# EAGLE design rf_ia (EAGLE 5.11)
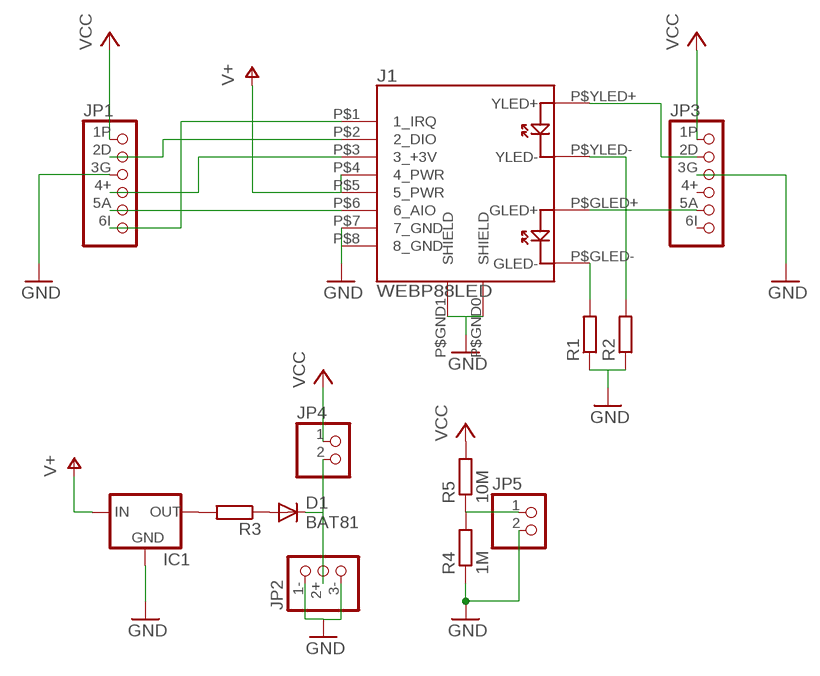
[diagram p0: schematic, sheet 1]

## Parts
D1  BAT81  [DO34-7]
IC1  78LXX  [78LXX]
J1  WEBP88LED  [WEBP88LED]
JP1  JEENODEPORT  [JEENODEPORT]
JP2  PWR3PIN  [PWR3PIN]
JP3  JEENODEPORT  [JEENODEPORT]
JP4  PINHD-1X2  [1X02]
JP5  PINHD-1X2  [1X02]
R1  R-EU_0207/7  [0207/7]
R2  R-EU_0207/7  [0207/7]
R3  R-EU_0204/7  [0204/7]
R4  1M  R-EU_0207/7  [0207/7]
R5  10M  R-EU_0207/7  [0207/7]

## Nets
GND: IC1.GND J1.P$7(7_GND) J1.P$8(8_GND) J1.P$GND0(SHIELD) J1.P$GND1(SHIELD) JP1.3G JP2.1- JP2.3- JP3.3G JP5.2 R1.1 R2.1 R4.1
N$1: J1.P$GLED-(GLED-) R1.2
N$2: J1.P$YLED-(YLED-) R2.2
N$3: D1.A R3.1
N$4: D1.C JP2.2+ JP4.2
N$6: J1.P$1(1_IRQ) JP1.6I
N$7: J1.P$2(2_DIO) JP1.2D
N$8: J1.P$3(3_+3V) JP1.4+
N$9: J1.P$6(6_AIO) JP1.5A
N$10: J1.P$YLED+(YLED+) JP3.2D
N$11: J1.P$GLED+(GLED+) JP3.5A
N$12: IC1.OUT R3.2
N$18: JP5.1 R4.2 R5.1
V_BATT: IC1.IN J1.P$4(4_PWR) J1.P$5(5_PWR) ; supply symbol labelled V+
VCC: JP1.1P JP3.1P JP4.1 R5.2
Unconnected: JP3.4+ JP3.6I

## Library data of the parts
D1 = diode:BAT81: DIODE barrier diode
IC1 = v-reg:78LXX: VOLTAGE REGULATOR
J1 = Prcek:WEBP88LED
JP1 JP3 = Prcek:JEENODEPORT: JeeNode Port
JP2 = Prcek:PWR3PIN: Power 3 PIN
JP4 JP5 = pinhead:PINHD-1X2: PIN HEADER
R1-R5 = resistor:R-EU_: RESISTOR, European symbol

## Board
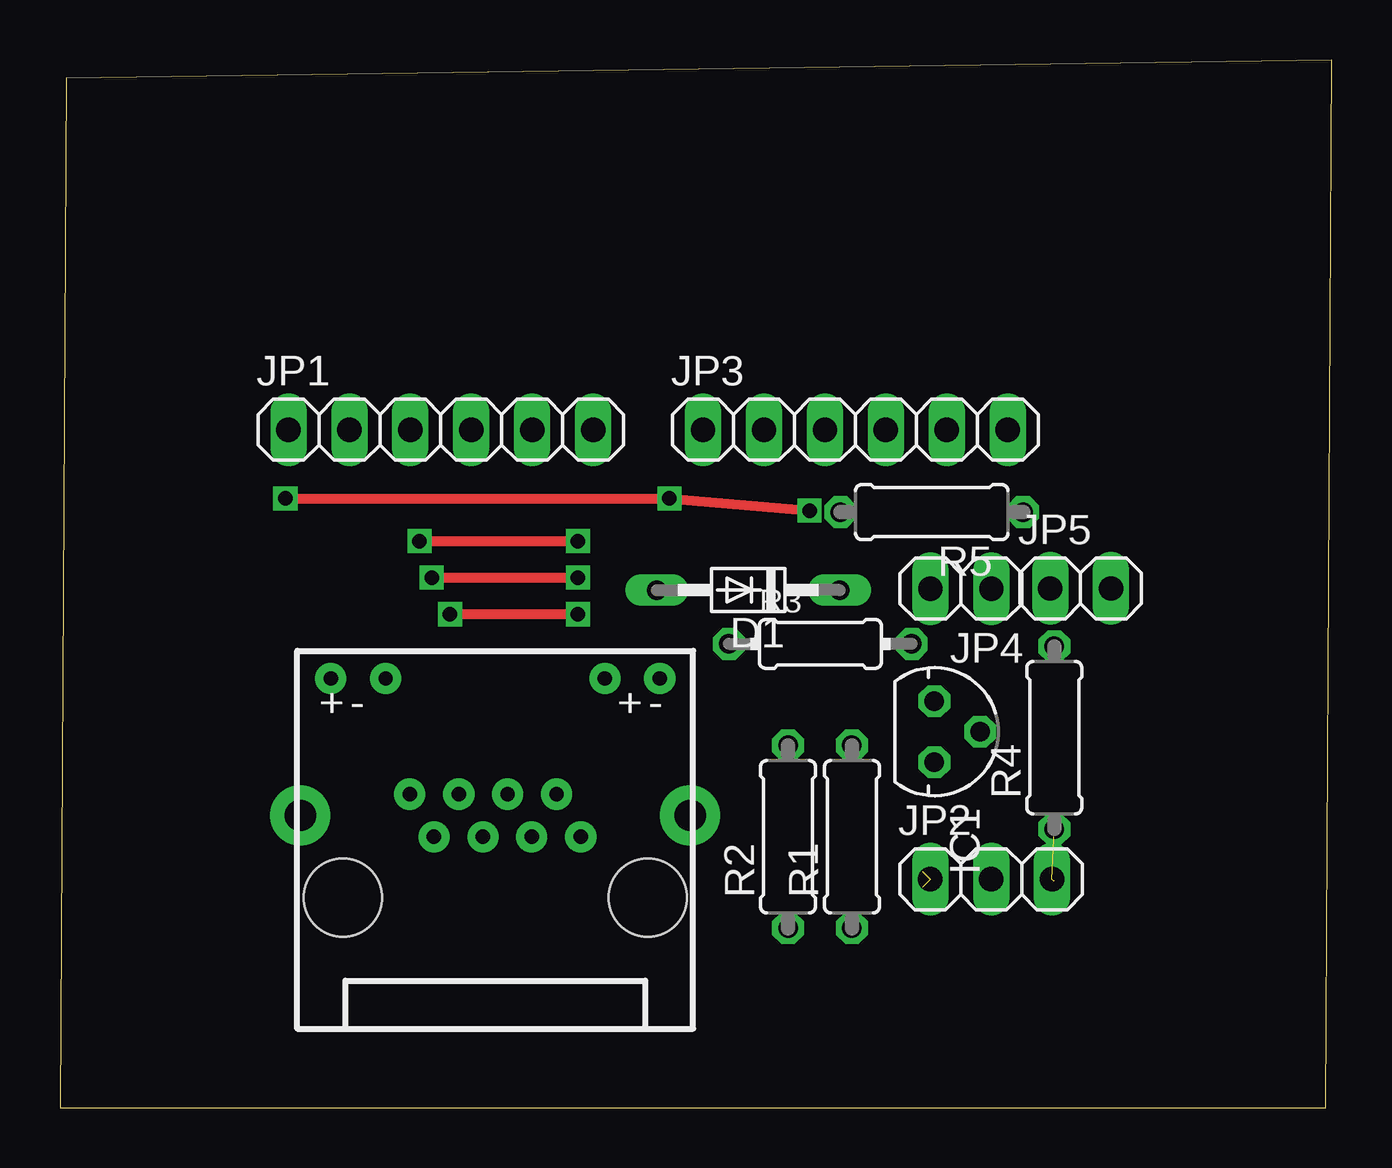
[diagram p1: board, top side]
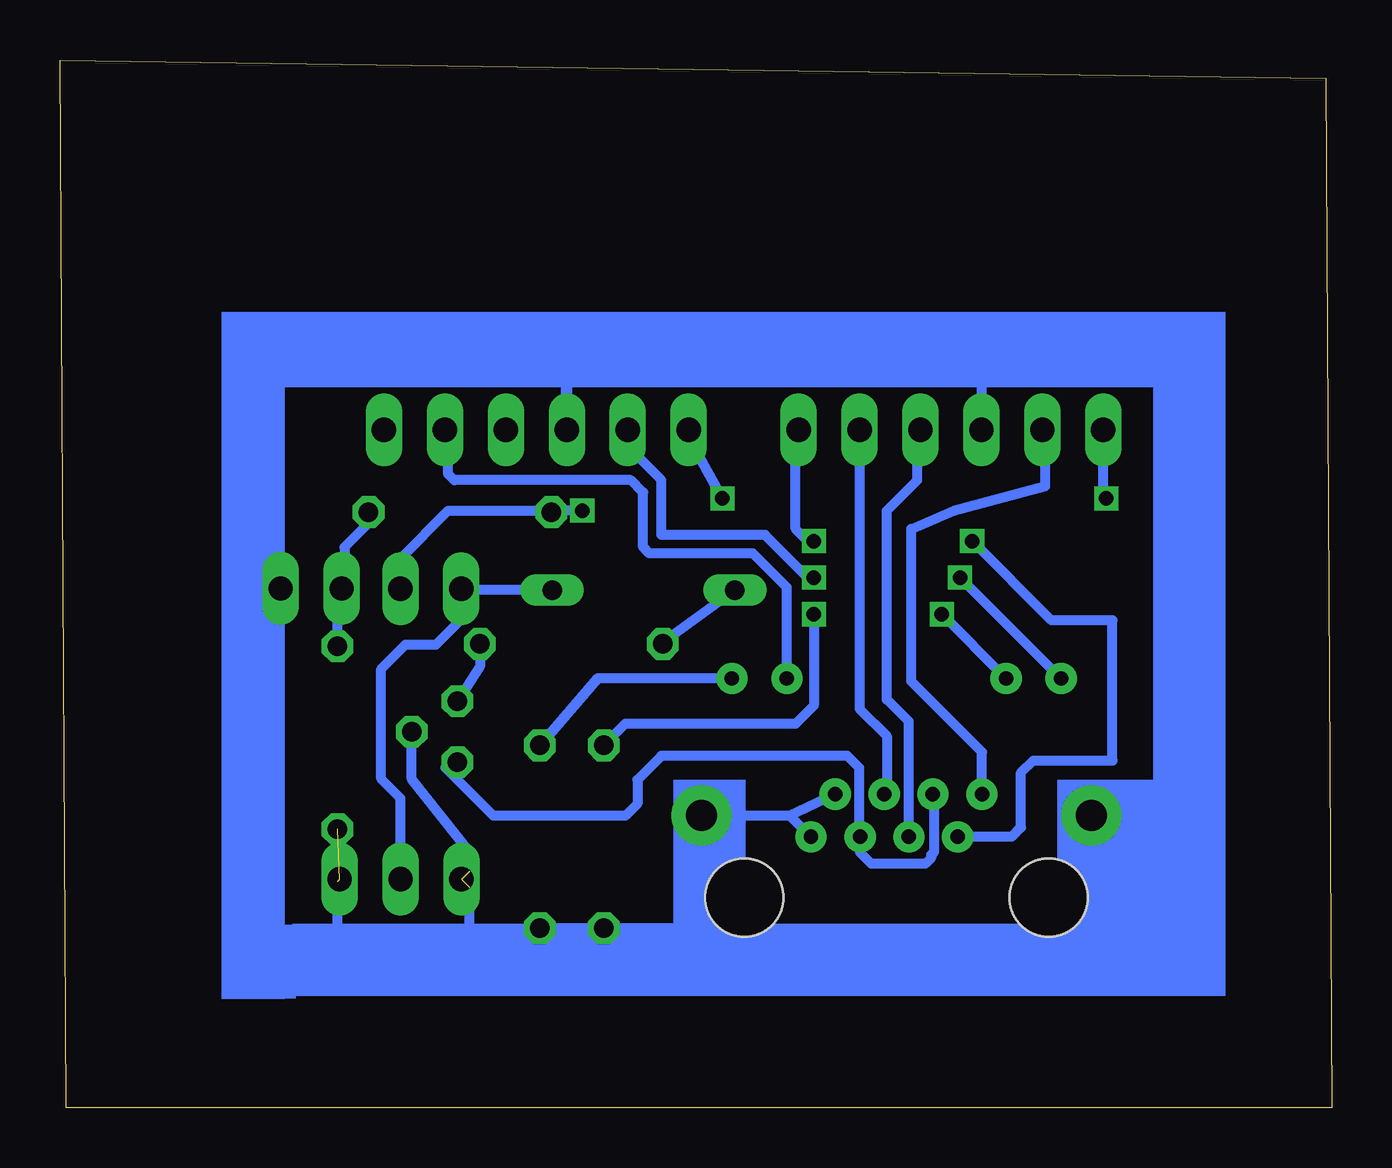
[diagram p2: board, bottom side, seen from below]

Size 53.01 x 43.68 mm. Coordinates in mm from the lower left corner, seen from the top.
Outline: 0,0 52.76,0 53.01,43.68 0.25,42.92 0,0
Copper layers (1*16): Top 0.035mm / dielectric 1.5mm / Bottom 0.035mm
Design rules "default": minimum track width 10mil, minimum drill 24mil, track to track 8mil, track to pad 8mil, pad to pad 8mil, via to via 8mil, smd to smd 8mil, copper to edge 40mil, drill to drill 8mil, minimum pad ring 10mil, minimum via ring 8mil, stop-mask expansion 4mil, vias tented up to drill 0mil, thermal gap 10mil

### Footprints (pad centres in the part's own frame; a part is rotated, then mirrored left to right if it is on the bottom)
DO34-7 = drill 0.813 long: A 3.81,0; C -3.81,0
78LXX = drill 0.813 octagon: GND 0,1.905; IN 1.27,0; OUT -1.27,0
WEBP88LED = drill 0.6 pad 1.3 round: P$1 -2.554,2.54; P$2 -3.566,4.32; P$3 -0.514,2.54; P$4 -1.516,4.32; P$5 1.516,2.54; P$6 0.514,4.32; P$7 3.566,2.54; P$8 2.554,4.32; P$GLED+ 4.57,9.14; P$GLED- 6.86,9.14; P$YLED+ -6.86,9.14; P$YLED- -4.57,9.14 | drill 1.3 pad 2.5 round: P$GND0 -8.125,3.43; P$GND1 8.125,3.43 | hole 3.25: -6.35,0; 6.35,0
JEENODEPORT = drill 1.016 long: 1P -6.35,0; 2D -3.81,0; 3G -1.27,0; 4+ 1.27,0; 5A 3.81,0; 6I 6.35,0
PWR3PIN = drill 1.016 long: 1- -2.54,0; 2+ 0,0; 3- 2.54,0
1X02 = drill 1.016 long: 1 -1.27,0; 2 1.27,0
0207/7 = drill 0.813 octagon: 1 -3.81,0; 2 3.81,0
0204/7 = drill 0.813 octagon: 1 -3.81,0; 2 3.81,0

### Placement (x,y rotation side)
D1  28.69,21.58 180 top
IC1  36.44,15.68 270 top
J1  18.14,8.76 0 top
JP1  15.87,28.27 0 top
JP2  38.81,9.53 0 top
JP3  33.15,28.27 0 top
JP4  37.55,21.64 180 top
JP5  42.54,21.65 0 top
R1  33.01,11.3 90 top
R2  30.34,11.3 90 top
R3  31.69,19.34 0 top
R4  41.44,15.43 90 top
R5  36.34,24.83 180 top

### Tracks (layer width: path | path; a pad name or v marks a point on that pad's centre or on a via)
GND  (4 unrouted)
  Bottom 0.406: R2.1 R1.1 27.03,7.49 | J1.P$GND0 10.02,12.06 9.25,11.3 9.25,6.22 27.03,6.22 | 27.03,7.49 27.03,6.22 | 27.03,7.49 27.03,11.42 J1.P$GND1 | J1.P$GND1 22.6,12.19 | 22.6,12.19 J1.P$8 | J1.P$7 22.6,12.19 | J1.P$GND1 26.27,5.85 26.44,5.68 9.44,5.68 9.44,12.68 | 27.03,6.22 41.4,6.22 | 41.4,6.22 41.44,6.18 | 41.44,6.18 41.44,9.44 | 41.4,6.22 41.35,6.27 | 41.44,6.18 36.44,6.18 | 36.44,6.18 35.94,6.18 35.94,6.68 | 35.94,6.68 35.94,9.2 | IC1.GND 38.35,13.71 35.94,10.68 35.94,9.86 | 31.94,31.18 14.44,31.18 14.6,31.02 JP1.3G | 31.94,31.18 31.94,28.33 JP3.3G 31.88,31.12 31.94,31.18 | 31.94,31.18 44.91,31.18 44.91,22.46 45.72,22.16 45.41,21.65 | 41.44,6.18 45.42,6.18 45.21,9.27 45.21,20.83 45.41,21.65 | 36.44,6.18 35.94,6.68 | R4.1 41.35,11.62 | 45.41,21.65 JP5.2
N$1
  Bottom 0.406: J1.P$GLED- 30.59,17.9 R1.2
N$2  (via drill 0.6)
  Top 0.406: v16.26,20.57 v21.59,20.57
  Bottom 0.406: J1.P$YLED- v16.26,20.57 | v21.59,20.57 21.59,16.76 22.35,16 29.45,16 R2.2
N$3
  Bottom 0.406: D1.A 27.92,19.38 R3.1
N$4
  Bottom 0.406: D1.C 36.23,21.58 JP4.2 36.07,21.43 36.07,20.57 37.34,19.3 38.61,19.3 39.62,18.29 39.62,13.72 38.81,12.91 JP2.2+
N$6  (via drill 0.6)
  Top 0.406: v14.99,23.62 v21.59,23.62
  Bottom 0.406: J1.P$1 13.34,11.3 12.95,11.68 12.95,13.97 12.45,14.48 9.14,14.48 9.14,20.32 11.68,20.32 v14.99,23.62 | v21.59,23.62 21.84,23.62 22.35,24.13 22.35,28.14 JP1.6I
N$7
  Bottom 0.406: J1.P$2 14.58,14.83 17.53,17.78 17.53,24.13 15.75,24.89 11.94,25.91 11.94,28.14 JP1.2D
N$8
  Bottom 0.406: J1.P$3 17.63,16.11 18.54,17.02 18.54,24.89 17.27,26.16 17.27,27.18 17.02,27.43 17.02,28.14 JP1.4+
N$9
  Bottom 0.406: JP1.5A 19.68,16.64 18.54,15.49 18.54,13.19 J1.P$6
N$10  (via drill 0.6)
  Top 0.406: v15.49,22.1 v21.59,22.1
  Bottom 0.406: J1.P$YLED+ v15.49,22.1 | v21.59,22.1 21.84,22.1 23.62,23.88 27.94,23.88 27.94,26.16 29.21,27.43 29.21,28.13 JP3.2D
N$11
  Bottom 0.406: J1.P$GLED+ 22.71,21.7 24.13,23.11 28.45,23.11 28.7,23.37 28.7,25.65 29.21,26.16 36.58,26.16 36.83,26.42 36.83,28.13 JP3.5A
N$12
  Bottom 0.406: R3.2 35.5,18.39 IC1.OUT
N$18
  Bottom 0.406: R4.2 41.44,21.48 JP5.1 41.15,21.77 41.15,23.37 40.15,24.37 R5.1
V_BATT
  Bottom 0.406: IC1.IN 36.94,14.18 34.94,12.18 29.44,12.18 28.94,12.68 28.94,13.68 27.94,14.68 20.19,14.68 19.69,14.18 19.69,11.33 J1.P$5 19.66,10.64 19.19,10.18 16.94,10.18 16.69,10.43 16.69,10.55 16.57,10.68 16.57,13.02 J1.P$4
VCC  (via drill 0.6)
  Top 0.406: v9.4,25.4 v25.4,25.4 v31.24,24.89
  Bottom 0.406: JP1.1P 9.52,25.78 v9.4,25.4 | v25.4,25.4 26.92,28.15 JP3.1P | v31.24,24.89 32.47,24.89 R5.2 32.59,24.89 36.83,24.89 38.82,22.9 JP4.1
(copper drawn outside any net)
  shapes: Bottom area x19